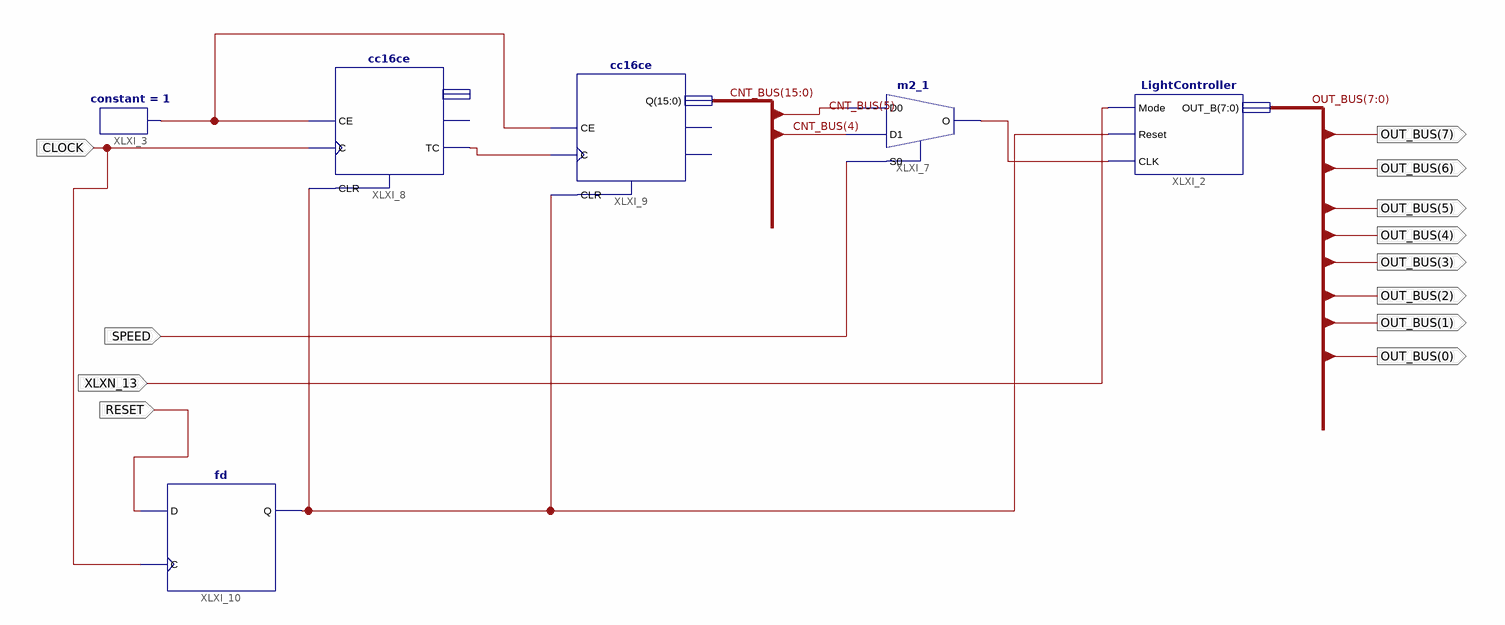
[diagram p0: schematic sheet 1]
// Xilinx ISE schematic TopLevel.sch (spartan3a) as structural Verilog: 6 symbols, 12 ports
module TopLevel (
  input  CLOCK,
  input  SPEED,
  input  XLXN_13,
  input  RESET,
  output [7:0] OUT_BUS
);

  wire XLXN_4, XLXN_7, XLXN_17, XLXN_24;
  wire [15:0] CNT_BUS;

  constant #(.CValue("1")) XLXI_3 (.O(XLXN_4));
  m2_1 XLXI_7 (.D0(CNT_BUS[5]), .D1(CNT_BUS[4]), .S0(SPEED), .O(XLXN_24));
  LightController XLXI_2 (.Mode(XLXN_13), .Reset(XLXN_17), .CLK(XLXN_24), .OUT_B(OUT_BUS));
  cc16ce XLXI_9 (.C(XLXN_7), .CE(XLXN_4), .CLR(XLXN_17), .Q(CNT_BUS));  // open: CEO, TC
  cc16ce XLXI_8 (.C(CLOCK), .CE(XLXN_4), .CLR(XLXN_17), .TC(XLXN_7));  // open: CEO, Q
  fd XLXI_10 (.C(CLOCK), .D(RESET), .Q(XLXN_17));
endmodule
